# EAGLE design Blinky (EAGLE 8.2.1)
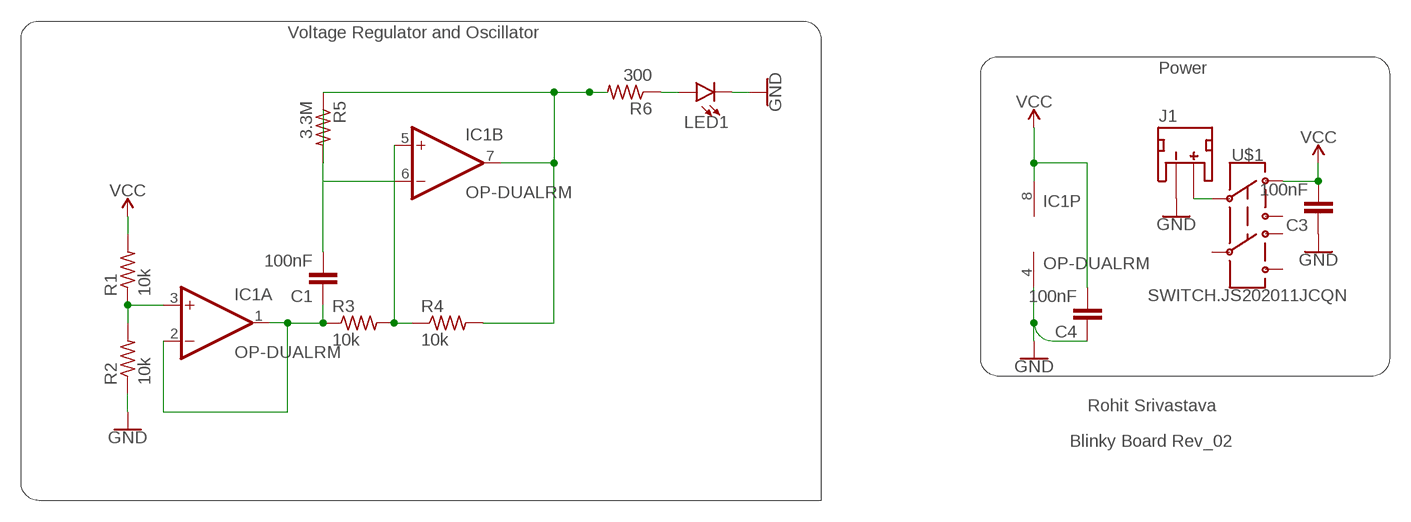
[diagram p0: schematic, sheet 1]

## Parts
C1  100nF  CAPACITOR0402  [C0402]
C3  100nF  CAPACITOR0402  [C0402]
C4  100nF  CAPACITOR0402  [C0402]
IC1  OP-DUALRM  [MSOP08]
J1  JST_2MM_MALE  [JST-2-SMD]
LED1  LED0603  [LED-0603]
R1  10k  RESISTOR0402  [R0402]
R2  10k  RESISTOR0402  [R0402]
R3  10k  RESISTOR0402  [R0402]
R4  10k  RESISTOR0402  [R0402]
R5  3.3M  RESISTOR0402  [R0402]
R6  300  RESISTOR0402  [R0402]
U$1  SWITCH.JS202011JCQN  [SWITCH.00]

## Nets
GND: C3.1 C4.1 IC1.4(P:V-) J1.1(-) LED1.C R2.1
N$2: J1.2(+) U$1.2
N$3: C1.1 IC1.1(A:OUT) IC1.2(A:-IN) R3.1
N$4: IC1.5(B:+IN) R3.2 R4.1
N$5: C1.2 IC1.6(B:-IN) R5.2
N$6: IC1.3(A:+IN) R1.1 R2.2
N$7: IC1.7(B:OUT) R4.2 R5.1 R6.2
N$8: LED1.A R6.1
VCC: C3.2 C4.2 IC1.8(P:V+) R1.2 U$1.1
Unconnected: J1.NC1(PAD1) J1.NC2(PAD2) U$1.3 U$1.5 U$1.6 U$1.7

## Notes on the sheet
- Voltage Regulator and Oscillator
- Power
- Rohit Srivastava
- Blinky Board Rev_02

## Library data of the parts
C1 C3 C4 = CalvEngIO-Passives:CAPACITOR
IC1 = CalvEngIO-AnalogIC:OP-DUAL: Precision Micropower, Low Noise CMOS, Rail-to-Rail Input/Output Operational Amplifiers Source: http://www.analog.com/static/imported-files/data_sheets/AD8603_8607_8609.pdf; MF: ALTERA CORPORATION; MPN: AD8607ARMZ-REEL; OC_FARNELL: 1464990; OC_NEWARK: 59K6925
J1 = CalvEngIO-Connectors:JST_2MM_MALE: JST 2MM MALE RA CONNECTOR Two pin, compact surface mount connector. Commonly used as a battery input connection point. We really like the solid locking feeling and high current rating on these small connectors. We use these all the time as battery connectors. Mates to single-cell LiPo batteries. Here is the connector we sell at SparkFun: JST Right Angle Connector - White <https://www.sparkfun.com/products/8612> (PRT-08612) Datasheet <http://www.sparkfun.com/datasheets/Prototyping/Connectors/JST-Horizontal.pdf> It was used on these SparkFun products: SparkFun MOSFET Power Controller <https://www.sparkfun.com/products/11214> (PRT-11214) SparkFun Battery Babysitter - LiPo Battery Manager <https://www.sparkfun.com/products/13777> (PRT-13777) And many, many others that required a lipo battery connection.; PROD_ID: CONN-11443; SF_ID: PRT-08612
LED1 = CalvEngIO-LED:LED: LED (Generic) Standard schematic elements and footprints for 5mm, 3mm, 1206, and 0603 sized LEDs. Generic LEDs with no color specified. LTST-C190KGKT: arrow indicates cathode
R1-R6 = CalvEngIO-Passives:RESISTOR
U$1 = CalvEngIO-Switches:SWITCH.JS202011JCQN

## Net classes
0 default: width 0.203 mm, drill 0.508 mm, clearance 0.203 mm

## Board
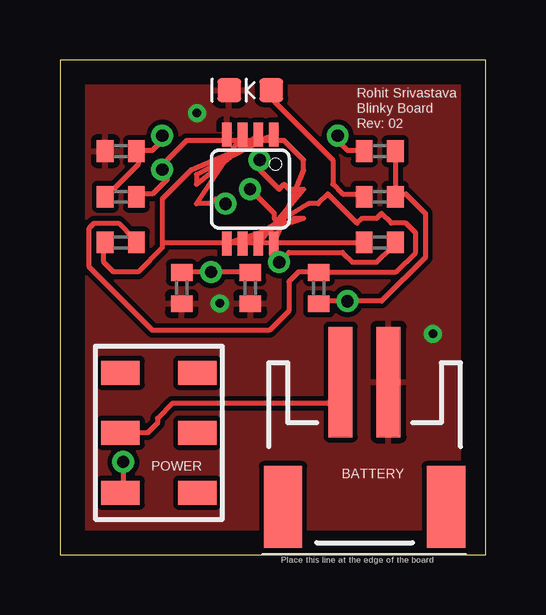
[diagram p1: board, top side]
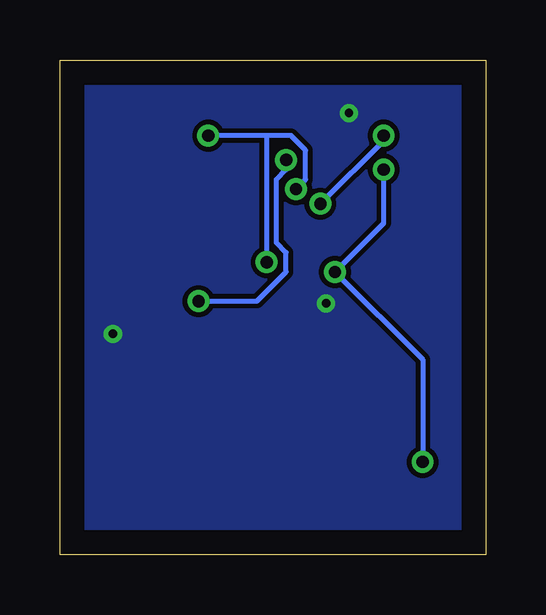
[diagram p2: board, bottom side, seen from below]

Size 17.77 x 20.63 mm. Coordinates in mm from the lower left corner, seen from the top.
Outline: 0,0 17.77,0 17.77,20.63 0,20.63 0,0
Copper layers (1*16): Top 0.035mm / dielectric 1.5mm / Bottom 0.035mm
Design rules "default": minimum track width 6mil, minimum drill 0.35mm, track to track 6mil, track to pad 6mil, pad to pad 6mil, via to via 6mil, smd to smd 6mil, copper to edge 40mil, drill to drill 6mil, minimum pad ring 10mil, minimum via ring 8mil, stop-mask expansion 4mil, vias tented up to drill 0mil, thermal gap 10mil

### Footprints (pad centres in the part's own frame; a part is rotated, then mirrored left to right if it is on the bottom)
C0402 = smd 0.7 x 0.9: 1 -0.65,0; 2 0.65,0
MSOP08 = smd 0.4 x 1: 1 -0.976,-2.263; 2 -0.326,-2.263; 3 0.324,-2.263; 4 0.974,-2.263; 5 0.974,2.262; 6 0.324,2.262; 7 -0.326,2.262; 8 -0.976,2.262
JST-2-SMD = smd 1 x 4.6: 1 -1,-3.7; 2 1,-3.7 | smd 1.6 x 3.4: NC1 -3.4,1.5; NC2 3.4,1.5
LED-0603 = smd 1 x 1: A -0.877,0; C 0.877,0
R0402 = smd 0.7 x 0.9: 1 -0.65,0; 2 0.65,0
SWITCH.00 = smd 1 x 1.6: 1 -2.5,1.6; 2 0,1.6; 3 2.5,1.6; 5 -2.5,-1.6; 6 0,-1.6; 7 2.5,-1.6

### Placement (x,y rotation side)
C1  2.54,13.02 0 top
C3  5.08,11.11 90 top
C4  7.94,11.11 90 top
IC1  7.94,15.24 180 top
J1  12.7,3.49 180 top
LED1  7.94,19.37 180 top
R1  2.54,14.92 0 top
R2  2.54,16.83 0 top
R3  13.34,13.02 0 top
R4  13.34,16.83 0 top
R5  10.79,11.11 90 top
R6  13.34,14.92 0 top
U$1  4.13,5.08 90 top

### Tracks (layer width: path | path; a pad name or v marks a point on that pad's centre or on a via)
GND  (via drill 0.35)
  Top 0.203: 7.86,10.54 7.92,10.57 C4.1 7.92,10.36
  other vias: 15.56,9.21 6.67,10.48 5.71,18.41
  pour Top: -0.64,20.95 18.41,20.95 18.41,20.64 18.41,-0.95 -0.95,-0.95 -0.95,-0.64 -0.95,20.95
  pour Bottom: -0.32,20.64 18.1,20.64 18.1,-0.32 0,-0.32 0,0 -0.32,0 -0.32,20.32
N$2
  Top 0.203: U$1.2 3.66,5.08 4.06,5.49 4.06,5.69 4.67,6.3 11.18,6.3 11.58,6.71 11.58,7.11 J1.2
N$3
  Top 0.203: 4.27,13.01 4.27,14.83 5.49,16.05 IC1.1 5.69,15.85 5.69,15.44 IC1.2 | 4.27,13.01 4.27,12.8 3.25,11.79 2.23,11.79 1.83,12.19 1.83,13.01 C1.1 | 4.27,13.01 12.6,13.01 R3.1
N$4  (via drill 0.51)
  Top 0.203: v11.58,17.48 11.58,17.27 11.99,16.87 12.6,16.87 R4.1 | v7.92,15.24 8.94,14.22 8.94,14.02 9.14,13.82 9.55,13.82 9.75,14.02 10.16,14.02 IC1.5 | v9.14,12.19 9.55,12.6 11.79,12.6 12.19,12.19 13.21,12.19 13.82,12.8 13.82,13.01 R3.2
  Bottom 0.203: 9.14,17.48 8.13,17.48 7.52,16.87 7.52,15.65 v7.92,15.24 | 9.14,17.48 v11.58,17.48 | 9.14,17.48 v9.14,12.19
N$5
  Top 0.203: C1.2 3.05,13.21 2.44,13.82 1.42,13.82 1.22,13.61 1.22,11.99 3.86,9.35 8.74,9.35 9.55,10.16 9.55,11.38 9.96,11.79 10.77,11.79 R5.2 10.97,11.79 14.02,11.79 14.83,12.6 14.83,13.41 14.43,13.82 13.82,13.82 13.41,14.22 13.21,14.02 12.6,14.02 12.39,13.82 11.18,15.04 10.77,14.63 10.36,14.63 IC1.6
N$6  (via drill 0.51)
  Top 0.203: R1.1 2.03,15.04 3.25,16.26 3.25,16.66 R2.2 3.25,16.87 3.86,16.87 4.27,17.27 v4.27,17.48 | v6.91,14.63 6.71,14.63 6.5,14.83 6.3,14.63 5.69,14.63 IC1.3
  Bottom 0.203: v6.91,14.63 4.27,17.27 v4.27,17.48
N$7  (via drill 0.51)
  Top 0.203: 14.02,15.04 14.43,15.04 15.24,14.22 15.24,12.39 13.41,10.57 v11.99,10.57 10.97,10.57 R5.1 | 14.02,15.04 14.02,16.66 R4.2 | 14.02,15.04 R6.2 | v8.33,16.46 8.33,16.05 9.14,15.24 9.35,15.44 9.55,15.24 10.16,15.24 IC1.7
  Bottom 0.203: v8.33,16.46 8.33,16.05 8.74,15.65 8.74,13.01 8.33,12.6 8.33,11.79 9.55,10.57 v11.99,10.57
N$8
  Top 0.203: R6.1 12.6,15.04 11.79,15.04 11.38,15.44 11.38,16.46 8.94,18.9 8.94,19.3 LED1.A
VCC  (via drill 0.51)
  Top 0.203: 4.47,16.05 4.47,16.46 5.28,17.27 9.35,17.27 10.16,16.46 10.16,16.05 IC1.8 | 4.47,16.05 4.47,15.65 3.86,15.04 3.25,15.04 R1.2 | C3.2 5.08,11.79 v6.3,11.79 7.92,11.79 C4.2 | v2.64,3.86 2.64,2.64 U$1.1 | v4.27,16.05 4.47,16.05
  Bottom 0.203: v2.64,3.86 2.64,8.13 v6.3,11.79 4.27,13.82 v4.27,16.05

### Text on the board
tNames: Rohit Srivastava | Blinky Board | Rev: 02 | POWER | BATTERY